# EAGLE design shieldRelay (EAGLE 9.6.2)

## Sheet 1 of 2
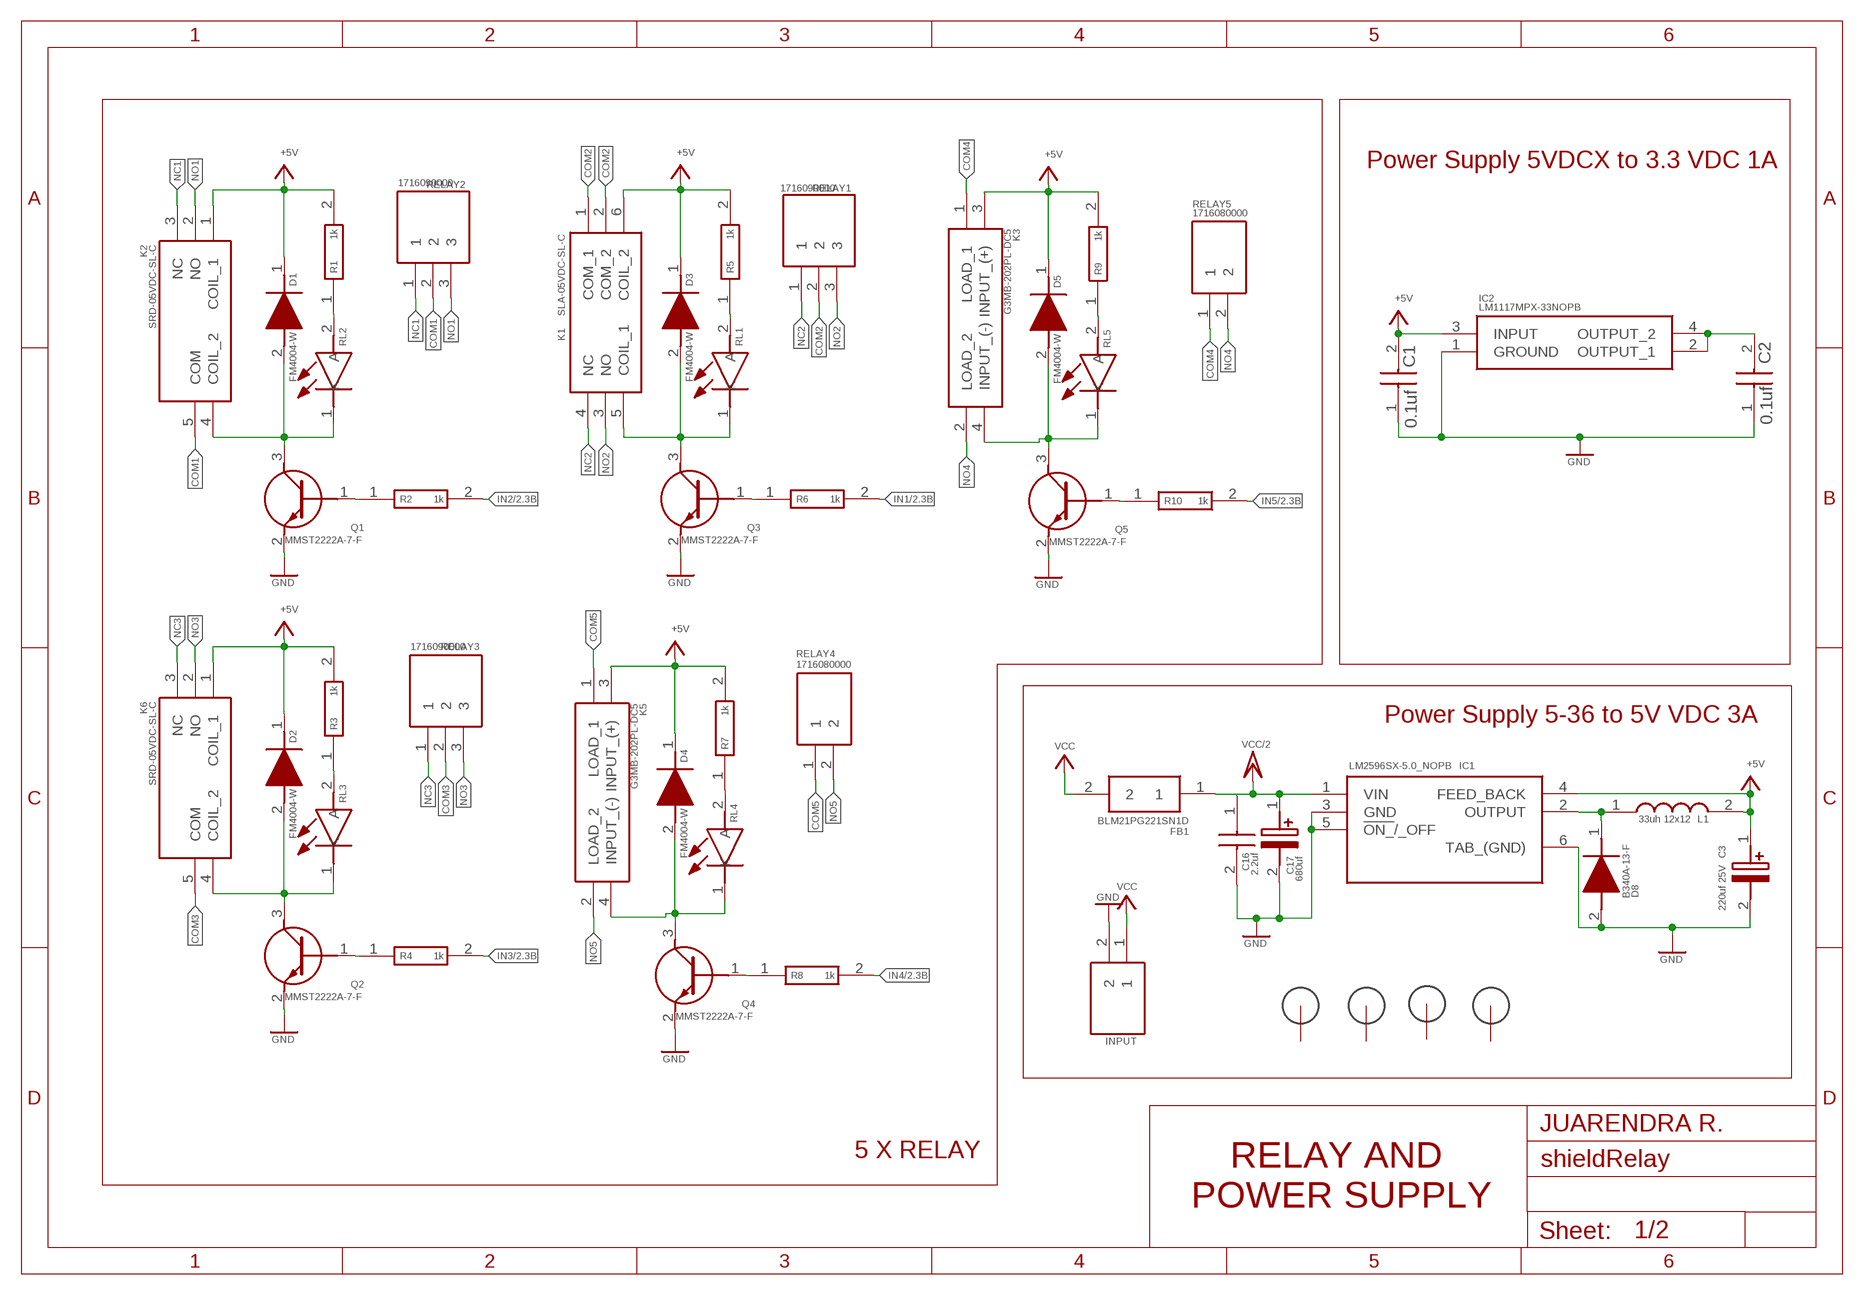
[diagram p0: schematic, sheet 1]

### Parts
C1  0.1uf  KGM15BR71E104KT  [CAPC1608X95N]
C2  0.1uf  KGM15BR71E104KT  [CAPC1608X95N]
C3  220uf 25V  MAL203836221E3  [CAPPRD350W60D850H1250]
C16  2.2uf  KAF21KR71H225KU  [CAPC2012X140N]
C17  680uf  EEH-ZU1V681UP  [EEHZS1H221P]
D1  FM4004-W  [DIONM5025X231N]
D2  FM4004-W  [DIONM5025X231N]
D3  FM4004-W  [DIONM5025X231N]
D4  FM4004-W  [DIONM5025X231N]
D5  FM4004-W  [DIONM5025X231N]
D8  B340A-13-F  [DIOM5226X240N]
FB1  BLM21PG221SN1D  [BEADC2012X105N]
H1  3MM_HOLE  [3MM_HOLE]
H2  3MM_HOLE  [3MM_HOLE]
H3  3MM_HOLE  [3MM_HOLE]
H4  3MM_HOLE  [3MM_HOLE]
IC1  LM2596SX-5.0_NOPB  [KTT0005B]
IC2  LM1117MPX-33NOPB  [SOT230P700X180-4N]
INPUT  1759017  [SHDRRA2W103P0X508_1X2_1016X120]
K1  SLA-05VDC-SL-C  [SLA05VDCSLC]
K2  SRD-05VDC-SL-C  [SRD05VDCSLC]
K3  G3MB-202PL-DC5  [G3MB202PLDC5]
K5  G3MB-202PL-DC5  [G3MB202PLDC5]
K6  SRD-05VDC-SL-C  [SRD05VDCSLC]
L1  33uh 12x12  744770133  [WE-PD_1260/1245/1280/121054]
Q1  MMST2222A-7-F  [SOT65P210X110-3N]
Q2  MMST2222A-7-F  [SOT65P210X110-3N]
Q3  MMST2222A-7-F  [SOT65P210X110-3N]
Q4  MMST2222A-7-F  [SOT65P210X110-3N]
Q5  MMST2222A-7-F  [SOT65P210X110-3N]
R1  1k  ERA-3AED102V  [ERA3AEB101V]
R2  1k  ERA-3AED102V  [ERA3AEB101V]
R3  1k  ERA-3AED102V  [ERA3AEB101V]
R4  1k  ERA-3AED102V  [ERA3AEB101V]
R5  1k  ERA-3AED102V  [ERA3AEB101V]
R6  1k  ERA-3AED102V  [ERA3AEB101V]
R7  1k  ERA-3AED102V  [ERA3AEB101V]
R8  1k  ERA-3AED102V  [ERA3AEB101V]
R9  1k  ERA-3AED102V  [ERA3AEB101V]
R10  1k  ERA-3AED102V  [ERA3AEB101V]
RELAY1  1716090000  [SHDR3W95P0X508_1X3_1524X1000X1]
RELAY2  1716090000  [SHDR3W95P0X508_1X3_1524X1000X1]
RELAY3  1716090000  [SHDR3W95P0X508_1X3_1524X1000X1]
RELAY4  1716080000  [1716080000]
RELAY5  1716080000  [1716080000]
RL1  150080SS75000  [LEDC2012X80N]
RL2  150080SS75000  [LEDC2012X80N]
RL3  150080SS75000  [LEDC2012X80N]
RL4  150080SS75000  [LEDC2012X80N]
RL5  150080SS75000  [LEDC2012X80N]

### Nets
+5V: C1.2 C3.1(+) D1.1(K) D2.1(K) D3.1(K) D4.1(K) D5.1(K) IC1.4(FEED_BACK) IC2.3(INPUT) K1.6(COIL_2) K2.1(COIL_1) K3.3(INPUT_(+)) K5.3(INPUT_(+)) K6.1(COIL_1) L1.2 R1.2 R3.2 R5.2 R7.2 R9.2 ; also sheet 2
COM1: K2.5(COM) RELAY2.2
COM2: K1.1(COM_1) K1.2(COM_2) RELAY1.2
COM3: K6.5(COM) RELAY3.2
COM4: K3.1(LOAD_1) RELAY5.1
COM5: K5.1(LOAD_1) RELAY4.1
GND: C1.1 C2.1 C3.2(-) C16.2 C17.2(-) D8.2(A) IC1.3(GND) IC1.5(!ON_!/_OFF) IC1.6(TAB_(GND)) IC2.1(GROUND) INPUT.2 Q1.2(E) Q2.2(E) Q3.2(E) Q4.2(E) Q5.2(E) ; also sheet 2
IN1: R6.2 ; also sheet 2
IN2: R2.2 ; also sheet 2
IN3: R4.2 ; also sheet 2
IN4: R8.2 ; also sheet 2
IN5: R10.2 ; also sheet 2
N$1: R3.1 RL3.2(A)
N$2: R1.1 RL2.2(A)
N$3: D1.2(A) K2.4(COIL_2) Q1.3(C) RL2.1(K)
N$4: Q1.1(B) R2.1
N$5: D2.2(A) K6.4(COIL_2) Q2.3(C) RL3.1(K)
N$6: Q2.1(B) R4.1
N$7: R5.1 RL1.2(A)
N$8: D3.2(A) K1.5(COIL_1) Q3.3(C) RL1.1(K)
N$9: Q3.1(B) R6.1
N$10: R7.1 RL4.2(A)
N$11: D4.2(A) K5.4(INPUT_(-)) Q4.3(C) RL4.1(K)
N$12: Q4.1(B) R8.1
N$13: R9.1 RL5.2(A)
N$14: D5.2(A) K3.4(INPUT_(-)) Q5.3(C) RL5.1(K)
N$15: Q5.1(B) R10.1
N$18: D8.1(K) IC1.2(OUTPUT) L1.1
N$38: C2.2 IC2.2(OUTPUT_1) IC2.4(OUTPUT_2)
NC1: K2.3(NC) RELAY2.1
NC2: K1.4(NC) RELAY1.1
NC3: K6.3(NC) RELAY3.1
NO1: K2.2(NO) RELAY2.3
NO2: K1.3(NO) RELAY1.3
NO3: K6.2(NO) RELAY3.3
NO4: K3.2(LOAD_2) RELAY5.2
NO5: K5.2(LOAD_2) RELAY4.2
VCC: FB1.2 INPUT.1
VCC/2: C16.1 C17.1(+) FB1.1 IC1.1(VIN) ; also sheet 2
Unconnected: H1.P$1(GND) H1.P$2(GND) H1.P$3(GND) H1.P$4(GND) H1.P$5(GND) H1.P$6(GND) H1.P$7(GND) H1.P$8(GND) H1.P$9(GND) H2.P$1(GND) H2.P$2(GND) H2.P$3(GND) H2.P$4(GND) H2.P$5(GND) H2.P$6(GND) H2.P$7(GND) H2.P$8(GND) H2.P$9(GND) H3.P$1(GND) H3.P$2(GND) H3.P$3(GND) H3.P$4(GND) H3.P$5(GND) H3.P$6(GND) H3.P$7(GND) H3.P$8(GND) H3.P$9(GND) H4.P$1(GND) H4.P$2(GND) H4.P$3(GND) H4.P$4(GND) H4.P$5(GND) H4.P$6(GND) H4.P$7(GND) H4.P$8(GND) H4.P$9(GND)

### Notes on the sheet
- Power Supply 5VDCX to 3.3 VDC 1A
- Power Supply 5-36 to 5V VDC 3A
- JUARENDRA R.
- 5 X RELAY
- RELAY AND 
  POWER SUPPLY

## Sheet 2 of 2
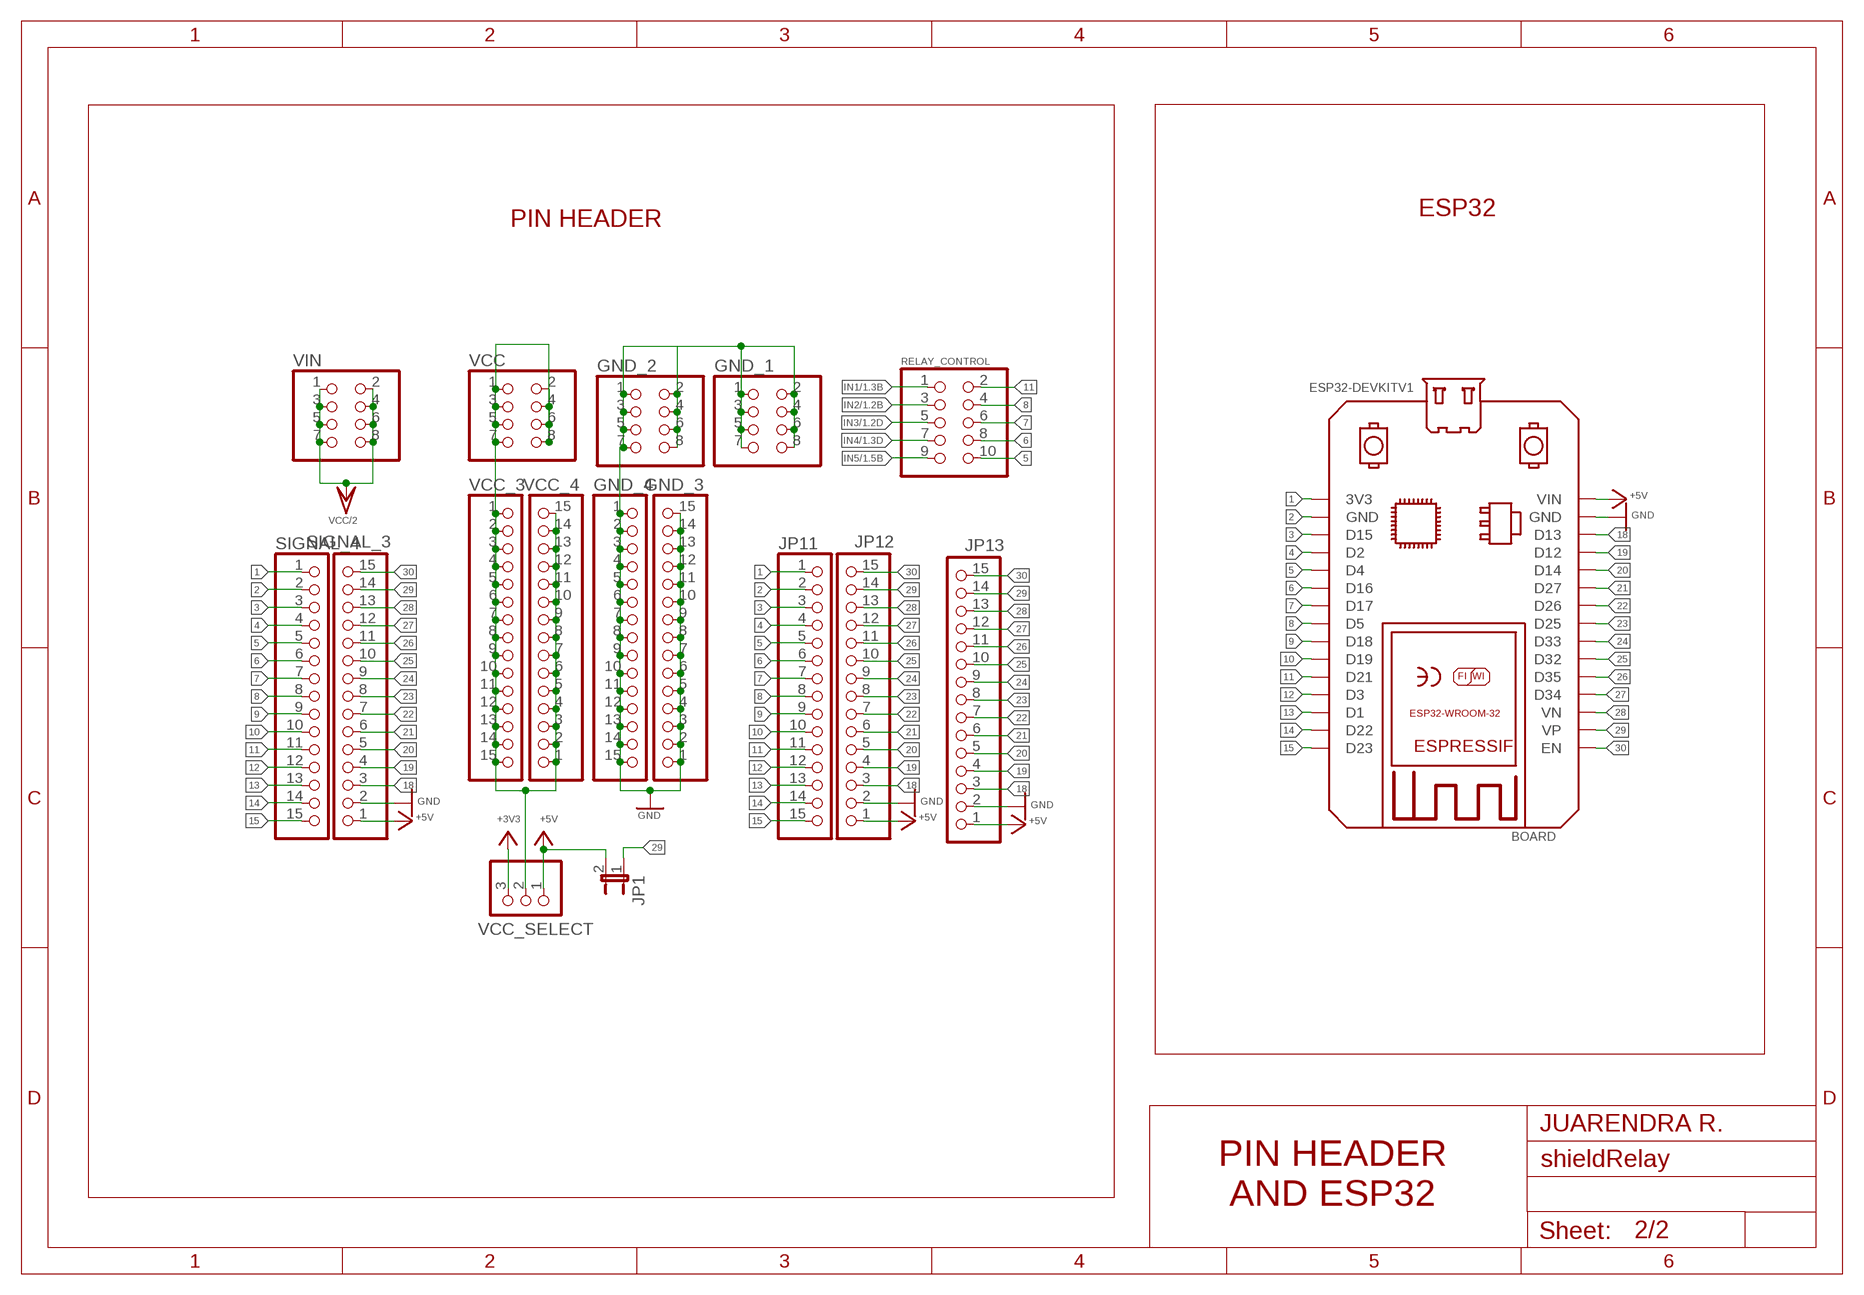
[diagram p1: schematic, sheet 2]

### Parts
BOARD  ESP32DEVKITV1  [ESP32-DEVKITV1]
GND_1  PINHD-2X4  [2X04]
GND_2  PINHD-2X4  [2X04]
GND_3  PINHD-1X15  [1X15]
GND_4  PINHD-1X15  [1X15]
JP1  JP1E  [JP1]
JP11  PINHD-1X15  [1X15]
JP12  PINHD-1X15  [1X15]
JP13  PINHD-1X15  [1X15]
RELAY_CONTROL  PINHD-2X5  [2X05]
SIGNAL_3  PINHD-1X15  [1X15]
SIGNAL_4  PINHD-1X15  [1X15]
VCC  PINHD-2X4  [2X04]
VCC_3  PINHD-1X15  [1X15]
VCC_4  PINHD-1X15  [1X15]
VCC_SELECT  PINHD-1X3  [1X03]
VIN  PINHD-2X4  [2X04]

### Nets
1: BOARD.3V3 JP11.1 SIGNAL_4.1
2: BOARD.GND@1(GND) JP11.2 SIGNAL_4.2
3: BOARD.D15 JP11.3 SIGNAL_4.3
4: BOARD.D2 JP11.4 SIGNAL_4.4
5: BOARD.D4 JP11.5 RELAY_CONTROL.10 SIGNAL_4.5
6: BOARD.D16 JP11.6 RELAY_CONTROL.8 SIGNAL_4.6
7: BOARD.D17 JP11.7 RELAY_CONTROL.6 SIGNAL_4.7
8: BOARD.D5 JP11.8 RELAY_CONTROL.4 SIGNAL_4.8
9: BOARD.D18 JP11.9 SIGNAL_4.9
10: BOARD.D19 JP11.10 SIGNAL_4.10
11: BOARD.D21 JP11.11 RELAY_CONTROL.2 SIGNAL_4.11
12: BOARD.D3 JP11.12 SIGNAL_4.12
13: BOARD.D1 JP11.13 SIGNAL_4.13
14: BOARD.D22 JP11.14 SIGNAL_4.14
15: BOARD.D23 JP11.15 SIGNAL_4.15
18: BOARD.D13 JP12.3 JP13.3 SIGNAL_3.3
19: BOARD.D12 JP12.4 JP13.4 SIGNAL_3.4
20: BOARD.D14 JP12.5 JP13.5 SIGNAL_3.5
21: BOARD.D27 JP12.6 JP13.6 SIGNAL_3.6
22: BOARD.D26 JP12.7 JP13.7 SIGNAL_3.7
23: BOARD.D25 JP12.8 JP13.8 SIGNAL_3.8
24: BOARD.D33 JP12.9 JP13.9 SIGNAL_3.9
25: BOARD.D32 JP12.10 JP13.10 SIGNAL_3.10
26: BOARD.D35 JP12.11 JP13.11 SIGNAL_3.11
27: BOARD.D34 JP12.12 JP13.12 SIGNAL_3.12
28: BOARD.VN JP12.13 JP13.13 SIGNAL_3.13
29: BOARD.VP JP1.1 JP12.14 JP13.14 SIGNAL_3.14
30: BOARD.EN JP12.15 JP13.15 SIGNAL_3.15
+3V3: VCC_SELECT.3
+5V: BOARD.VIN JP1.2 JP12.1 JP13.1 SIGNAL_3.1 VCC_SELECT.1 ; also sheet 1
GND: BOARD.GND GND_1.1 GND_1.2 GND_1.3 GND_1.4 GND_1.5 GND_1.6 GND_1.7 GND_1.8 GND_2.1 GND_2.2 GND_2.3 GND_2.4 GND_2.5 GND_2.6 GND_2.7 GND_2.8 GND_3.1 GND_3.2 GND_3.3 GND_3.4 GND_3.5 GND_3.6 GND_3.7 GND_3.8 GND_3.9 GND_3.10 GND_3.11 GND_3.12 GND_3.13 GND_3.14 GND_3.15 GND_4.1 GND_4.2 GND_4.3 GND_4.4 GND_4.5 GND_4.6 GND_4.7 GND_4.8 GND_4.9 GND_4.10 GND_4.11 GND_4.12 GND_4.13 GND_4.14 GND_4.15 JP12.2 JP13.2 SIGNAL_3.2 ; also sheet 1
IN1: RELAY_CONTROL.1 ; also sheet 1
IN2: RELAY_CONTROL.3 ; also sheet 1
IN3: RELAY_CONTROL.5 ; also sheet 1
IN4: RELAY_CONTROL.7 ; also sheet 1
IN5: RELAY_CONTROL.9 ; also sheet 1
N$39: VCC.1 VCC.2 VCC.3 VCC.4 VCC.5 VCC.6 VCC.7 VCC.8 VCC_3.1 VCC_3.2 VCC_3.3 VCC_3.4 VCC_3.5 VCC_3.6 VCC_3.7 VCC_3.8 VCC_3.9 VCC_3.10 VCC_3.11 VCC_3.12 VCC_3.13 VCC_3.14 VCC_3.15 VCC_4.1 VCC_4.2 VCC_4.3 VCC_4.4 VCC_4.5 VCC_4.6 VCC_4.7 VCC_4.8 VCC_4.9 VCC_4.10 VCC_4.11 VCC_4.12 VCC_4.13 VCC_4.14 VCC_4.15 VCC_SELECT.2
VCC/2: VIN.1 VIN.2 VIN.3 VIN.4 VIN.5 VIN.6 VIN.7 VIN.8 ; also sheet 1

### Notes on the sheet
- ESP32
- PIN HEADER
- JUARENDRA R.
- PIN HEADER
  AND ESP32

## Library data of the parts
BOARD = ESP32-DEVKITV1:ESP32DEVKITV1: https://github.com/shridattdudhat
C1 C2 = KGM15BR71E104KT:KGM15BR71E104KT: 0603 25 V X7R 100nF +/-10% Source: Datasheet <https://spicat.kyocera-avx.com/product/mlcc/chartview/KGM15BR71E104KT>; DESCRIPTION: 0603 25 V X7R 100nF +/-10%; HEIGHT: 0.95mm; MANUFACTURER_NAME: Kyocera AVX; MANUFACTURER_PART_NUMBER: KGM15BR71E104KT; MOUSER_PART_NUMBER: 581-KGM15BR71E104KT; MOUSER_PRICE-STOCK: https://www.mouser.co.uk/ProductDetail/KYOCERA-AVX/KGM15BR71E104KT?qs=Jm2GQyTW%2FbiCo%2Fby4Q068Q%3D%3D
C3 = MAL203836221E3:MAL203836221E3: VISHAY - MAL203836221E3 - CAP, 220F, 25V, 20% Source: Datasheet; DESCRIPTION: VISHAY - MAL203836221E3 - CAP, 220F, 25V, 20%; HEIGHT: 12.5mm; MANUFACTURER_NAME: Vishay; MANUFACTURER_PART_NUMBER: MAL203836221E3; MOUSER_PART_NUMBER: 594-MAL203836221E3; MOUSER_PRICE-STOCK: https://www.mouser.co.uk/ProductDetail/Vishay-BC-Components/MAL203836221E3?qs=G99oyVYclWUIwcN6B3qC5w%3D%3D
C16 = KAF21KR71H225KU:KAF21KR71H225KU: Multilayer Ceramic Capacitors MLCC - SMD/SMT 50V 2.2uF X7R 0805 10% AEC-Q200 FLEXITERM Source: Datasheet <https://datasheets.kyocera-avx.com/AutoMLCCKAF.pdf>; DESCRIPTION: Multilayer Ceramic Capacitors MLCC - SMD/SMT 50V 2.2uF X7R 0805 10% AEC-Q200 FLEXITERM; HEIGHT: 1.4mm; MANUFACTURER_NAME: Kyocera AVX; MANUFACTURER_PART_NUMBER: KAF21KR71H225KU; MOUSER_PART_NUMBER: 581-KAF21KR71H225KU; MOUSER_PRICE-STOCK: https://www.mouser.co.uk/ProductDetail/KYOCERA-AVX/KAF21KR71H225KU?qs=Jm2GQyTW%2FbjwwNTLmtUMeQ%3D%3D
C17 = EEH-ZU1V681UP:EEH-ZU1V681UP: Conductive Polymer Hybrid Aluminum Electrolytic Capacitor Source: Datasheet <https://industrial.panasonic.com/cdbs/www-data/pdf/RDD0000/ast-ind-280898.pdf>; DESCRIPTION: Conductive Polymer Hybrid Aluminum Electrolytic Capacitor; HEIGHT: 10.5mm; MANUFACTURER_NAME: Panasonic; MANUFACTURER_PART_NUMBER: EEH-ZU1V681UP; MOUSER_PART_NUMBER: 667-EEH-ZU1V681UP; MOUSER_PRICE-STOCK: https://www.mouser.co.uk/ProductDetail/Panasonic/EEH-ZU1V681UP?qs=HoCaDK9Nz5elLexP3akqig%3D%3D
D1-D5 = FM4004-W:FM4004-W: Rectifiers 1N4004 1A 400V Source: Datasheet <https://componentsearchengine.com/Datasheets/1/FM4004-W.pdf>; DESCRIPTION: Rectifiers 1N4004 1A 400V; HEIGHT: 2.31mm; MANUFACTURER_NAME: Rectron; MANUFACTURER_PART_NUMBER: FM4004-W; MOUSER_PART_NUMBER: 583-FM4004; MOUSER_PRICE-STOCK: https://www.mouser.co.uk/ProductDetail/Rectron/FM4004-W?qs=Iw9Ubr57Px3IHNH1bE4l9w%3D%3D
D8 = B340A-13-F:B340A-13-F: Schottky Diode 3A 40V 0.5Vf SMA Diodes Inc B340A-13-F, SMT Schottky Diode, 40V 3A, 2-Pin DO-214AC Source: Datasheet <https://datasheet.datasheetarchive.com/originals/distributors/Datasheets-305/73551.pdf>; DESCRIPTION: Schottky Diode 3A 40V 0.5Vf SMA Diodes Inc B340A-13-F, SMT Schottky Diode, 40V 3A, 2-Pin DO-214AC; HEIGHT: 2.4mm; MANUFACTURER_NAME: Diodes Incorporated; MANUFACTURER_PART_NUMBER: B340A-13-F; MOUSER_PART_NUMBER: 621-B340A-F; MOUSER_PRICE-STOCK: https://www.mouser.co.uk/ProductDetail/Diodes-Incorporated/B340A-13-F?qs=aLaTXeBcTP9fj%2FYKVo6Q1A%3D%3D
FB1 = BLM21PG221SN1D:BLM21PG221SN1D: Murata Ferrite Bead (Chip Ferrite Bead), 2 x 1.25 x 0.85mm Source: Datasheet <https://datasheet.datasheetarchive.com/originals/dk/DKDS-31/605570.pdf>; DESCRIPTION: Murata Ferrite Bead (Chip Ferrite Bead), 2 x 1.25 x 0.85mm; HEIGHT: 1.05mm; MANUFACTURER_NAME: Murata Electronics; MANUFACTURER_PART_NUMBER: BLM21PG221SN1D; MOUSER_PART_NUMBER: 81-BLM21P221SG; MOUSER_PRICE-STOCK: https://www.mouser.co.uk/ProductDetail/Murata-Electronics/BLM21PG221SN1D?qs=N%2FLoXOA9PTJ4i6RHFrsqmw%3D%3D
GND_1 GND_2 VCC VIN = pinhead:PINHD-2X4: PIN HEADER
GND_3 GND_4 JP11-JP13 SIGNAL_3 SIGNAL_4 VCC_3 VCC_4 = pinhead_mod:PINHD-1X15: PIN HEADER
H1-H4 = 3mm_special_hole:3MM_HOLE: Cool looking 3mm hole with ground connection
IC1 = LM2596SX-5.0_NOPB:LM2596SX-5.0_NOPB: SIMPLE SWITCHER® 4.5V to 40V, 3A Low Component Count Step-Down Regulator Source: Datasheet <http://www.ti.com/lit/gpn/lm2596>; DESCRIPTION: SIMPLE SWITCHER&#174; 4.5V to 40V, 3A Low Component Count Step-Down Regulator; HEIGHT: mm; MANUFACTURER_NAME: Texas Instruments; MANUFACTURER_PART_NUMBER: LM2596SX-5.0/NOPB; MOUSER_PART_NUMBER: 926-LM2596SX-5.0NOPB; MOUSER_PRICE-STOCK: https://www.mouser.co.uk/ProductDetail/Texas-Instruments/LM2596SX-5.0-NOPB?qs=X1J7HmVL2ZGZ5T4VcWdmNw%3D%3D
IC2 = LM1117MPX-33NOPB:LM1117MPX-33NOPB: LDO Voltage Regulators 800-mA 15-V linear voltage regulator 800-mA 15-V linear voltage regulator Source: Datasheet <https://www.arrow.com/en/products/lm1117mpx-33nopb/on-semiconductor>; DESCRIPTION: LDO Voltage Regulators 800-mA 15-V linear voltage regulator 800-mA 15-V linear voltage regulator; HEIGHT: 1.8mm; MANUFACTURER_NAME: onsemi; MANUFACTURER_PART_NUMBER: LM1117MPX-33NOPB; MOUSER_PART_NUMBER: 863-LM1117MPX-33NOPB; MOUSER_PRICE-STOCK: https://www.mouser.co.uk/ProductDetail/onsemi/LM1117MPX-33NOPB?qs=DPoM0jnrROUIbzbQHFmeig%3D%3D
INPUT = 1759017:1759017: PCB header, nominal cross section: 2.5 mm?, color: green, nominal current: 12 A, rated voltage (III/2): 320 V, contact surface: Tin, type of contact: Male connector, Number of potentials: 2, Number of rows: 1, Number of positions per row: 2, number of connections: 2, product range: MSTB 2,5/..-G, pitch: 5.08 mm, mounting: Wave soldering, pin layout: Linear pinning, solder pin [P]: 3.5 mm, Stecksystem: CLASSIC COMBICON, Locking: without, type of packaging: packed in cardboard Source: Datasheet <http://www.phoenixcontact.com/de/produkte/1759017/pdf>; DESCRIPTION: PCB header, nominal cross section: 2.5 mm?, color: green, nominal current: 12 A, rated voltage (III/2): 320 V, contact surface: Tin, type of contact: Male connector, Number of potentials: 2, Number of rows: 1, Number of positions per row: 2, number of connections: 2, product range: MSTB 2,5/..-G, pitch: 5.08 mm, mounting: Wave soldering, pin layout: Linear pinning, solder pin [P]: 3.5 mm, Stecksystem: CLASSIC COMBICON, Locking: without, type of packaging: packed in cardboard; HEIGHT: 8.72mm; MANUFACTURER_NAME: Phoenix Contact; MANUFACTURER_PART_NUMBER: 1759017; MOUSER_PART_NUMBER: 651-1759017; MOUSER_PRICE-STOCK: https://www.mouser.co.uk/ProductDetail/Phoenix-Contact/1759017?qs=BYlwlsDsB%2FoOYIHqYLxOcg%3D%3D
JP1 = jumper:JP1E: JUMPER
K1 = SLA-05VDC-SL-C:SLA-05VDC-SL-C: Relays General Purpose Non Latching 5VDC SPDT 30A (250VAC) Max Plugin RoHS Source: Datasheet <https://datasheet.lcsc.com/szlcsc/Ningbo-Songle-Relay-SLA-05VDC-SL-C_C87367.pdf>; DESCRIPTION: Relays General Purpose Non Latching 5VDC SPDT 30A (250VAC) Max Plugin RoHS; HEIGHT: 20.4mm; MANUFACTURER_NAME: Songle Relay; MANUFACTURER_PART_NUMBER: SLA-05VDC-SL-C
K2 K6 = SRD-05VDC-SL-C:SRD-05VDC-SL-C: SRD-05VDC-SL-C; RELAY ISO9002 1. MAIN FEATURES Switching capacity available by 10A in spite of small size design for highdensity P.C. board mounting technique. U Source: Datasheet <http://www.songlerelay.com/Public/Uploads/20161104/581c81ac16e36.pdf>; DESCRIPTION: SRD-05VDC-SL-C; RELAY ISO9002 1. MAIN FEATURES Switching capacity available by 10A in spite of small size design for highdensity P.C. board mounting technique. U; HEIGHT: 15.8mm; MANUFACTURER_NAME: EAGLE; MANUFACTURER_PART_NUMBER: SRD-05VDC-SL-C
K3 K5 = G3MB-202PL-DC5:G3MB-202PL-DC5: Solid State Relays - PCB Mount 5VDC/100-240VAC 2A Source: Datasheet <https://www.mouser.com/datasheet/2/307/g3mb_0609-1189645.pdf>; DESCRIPTION: Solid State Relays - PCB Mount 5VDC/100-240VAC 2A; HEIGHT: 20.5mm; MANUFACTURER_NAME: Omron Electronics; MANUFACTURER_PART_NUMBER: G3MB-202PL-DC5; MOUSER_PART_NUMBER: 653-G3MB-202PL-DC5; MOUSER_PRICE-STOCK: https://www.mouser.co.uk/ProductDetail/Omron-Automation-and-Safety/G3MB-202PL-DC5?qs=CX134%252BdLMDF4X9k4CH7R5g%3D%3D
L1 = 744770133:744770133: Wurth WE-PD Series Shielded Wire-wound SMD Inductor with a Ferrite Core, 33 uH +/-20% 3.6A Idc Source: Datasheet; DESCRIPTION: Wurth WE-PD Series Shielded Wire-wound SMD Inductor with a Ferrite Core, 33 uH +/-20% 3.6A Idc; HEIGHT: mm; MANUFACTURER_NAME: Wurth Elektronik; MANUFACTURER_PART_NUMBER: 744770133; MOUSER_PART_NUMBER: 710-744770133; MOUSER_PRICE-STOCK: https://www.mouser.co.uk/ProductDetail/Wurth-Elektronik/744770133?qs=E%2F%2FhvbtCqpPKkGJl8TxFXw%3D%3D
Q1-Q5 = MMST2222A-7-F:MMST2222A-7-F: Bipolar (BJT) Transistor NPN 40 V 600 mA 300MHz 200 mW Surface Mount SOT-323 Source: Datasheet <https://www.diodes.com/assets/Datasheets/ds30080.pdf>; DESCRIPTION: Bipolar (BJT) Transistor NPN 40 V 600 mA 300MHz 200 mW Surface Mount SOT-323; HEIGHT: 1.1mm; MANUFACTURER_NAME: Diodes Incorporated; MANUFACTURER_PART_NUMBER: MMST2222A-7-F; MOUSER_PART_NUMBER: 621-MMST2222A-F; MOUSER_PRICE-STOCK: https://www.mouser.co.uk/ProductDetail/Diodes-Incorporated/MMST2222A-7-F?qs=B0AElM0L7fPu4CagNNXsRQ%3D%3D
R1-R10 = ERA-3AED102V:ERA-3AED102V: Thin Film Resistors - SMD 0603 1000ohms 25ppm 0.5% AEC-Q200 Source: Datasheet <https://industrial.panasonic.com/cdbs/www-data/pdf/RDM0000/AOA0000C307.pdf>; DESCRIPTION: Thin Film Resistors - SMD 0603 1000ohms 25ppm 0.5% AEC-Q200; HEIGHT: 0.55mm; MANUFACTURER_NAME: Panasonic; MANUFACTURER_PART_NUMBER: ERA-3AED102V; MOUSER_PART_NUMBER: 667-ERA-3AED102V; MOUSER_PRICE-STOCK: https://www.mouser.co.uk/ProductDetail/Panasonic/ERA-3AED102V?qs=yocZuyCaXdNrh6oeFjCchg%3D%3D
RELAY1-RELAY3 = 1716090000:1716090000: Printed circuit board terminals, 5.08 mm, Number of poles: 3, 90, Solder pin length: 3.5 mm, tinned, orange, Clamping yoke connection, Clamping range, max. [rated connection]: 2.5 mm, Box Source: Datasheet <http://catalog.weidmueller.com/createDatasheetForMobile.do?ordernumber=1716090000&scope1=1&scope2=1&localeId=en>; DESCRIPTION: Printed circuit board terminals, 5.08 mm, Number of poles: 3, 90, Solder pin length: 3.5 mm, tinned, orange, Clamping yoke connection, Clamping range, max. [rated connection]: 2.5 mm, Box; HEIGHT: 13.8mm; MANUFACTURER_NAME: Weidmuller; MANUFACTURER_PART_NUMBER: 1716090000; MOUSER_PART_NUMBER: 470-1716090000; MOUSER_PRICE-STOCK: https://www.mouser.co.uk/ProductDetail/Weidmuller/1716090000?qs=BTG2th8YmhRwtiTHzuCKAQ%3D%3D
RELAY4 RELAY5 = 1716080000:1716080000: Printed circuit board terminals, 5.08 mm, Number of poles: 2, 90, Solder pin length: 3.5 mm, tinned, orange, Clamping yoke connection, Clamping range, max. [rated connection]: 2.5 mm, Box Source: Datasheet <http://catalog.weidmueller.com/createDatasheetForMobile.do?ordernumber=1716080000&scope1=1&scope2=1&localeId=en>; DESCRIPTION: Printed circuit board terminals, 5.08 mm, Number of poles: 2, 90, Solder pin length: 3.5 mm, tinned, orange, Clamping yoke connection, Clamping range, max. [rated connection]: 2.5 mm, Box; HEIGHT: 13.8mm; MANUFACTURER_NAME: Weidmuller; MANUFACTURER_PART_NUMBER: 1716080000; MOUSER_PART_NUMBER: 470-1716080000; MOUSER_PRICE-STOCK: https://www.mouser.co.uk/ProductDetail/Weidmuller/1716080000?qs=BTG2th8YmhQnu8ZhPH6LgQ%3D%3D
RELAY_CONTROL = pinhead:PINHD-2X5: PIN HEADER
RL1-RL5 = SamacSys_Parts:150080SS75000: Wurth Elektronik 150080SS75000, WL-SMCW Series Red LED, 630 nm, 2012 (0805) Clear, Rectangle Lens SMD Package Source: Datasheet <https://katalog.we-online.com/led/datasheet/150080SS75000.pdf>; DESCRIPTION: Wurth Elektronik 150080SS75000, WL-SMCW Series Red LED, 630 nm, 2012 (0805) Clear, Rectangle Lens SMD Package; DIGIKEY_PARTNUMBER: 732-4985-1-ND; DIGIKEY_PRICE-STOCK: https://www.digikey.com/product-detail/en/w%C3%BCrth-elektronik/150080SS75000/732-4985-1-ND/4489919; HEIGHT: 0.8mm; MANUFACTURER_NAME: Wurth Elektronik; MANUFACTURER_PART_NUMBER: 150080SS75000; MOUSER_PART_NUMBER: 710-150080SS75000; MOUSER_PRICE-STOCK: https://www.mouser.co.uk/ProductDetail/Wurth-Elektronik/150080SS75000?qs=LlUlMxKIyB2zzpiaOzrUdw%3D%3D
VCC_SELECT = pinhead:PINHD-1X3: PIN HEADER

## Board
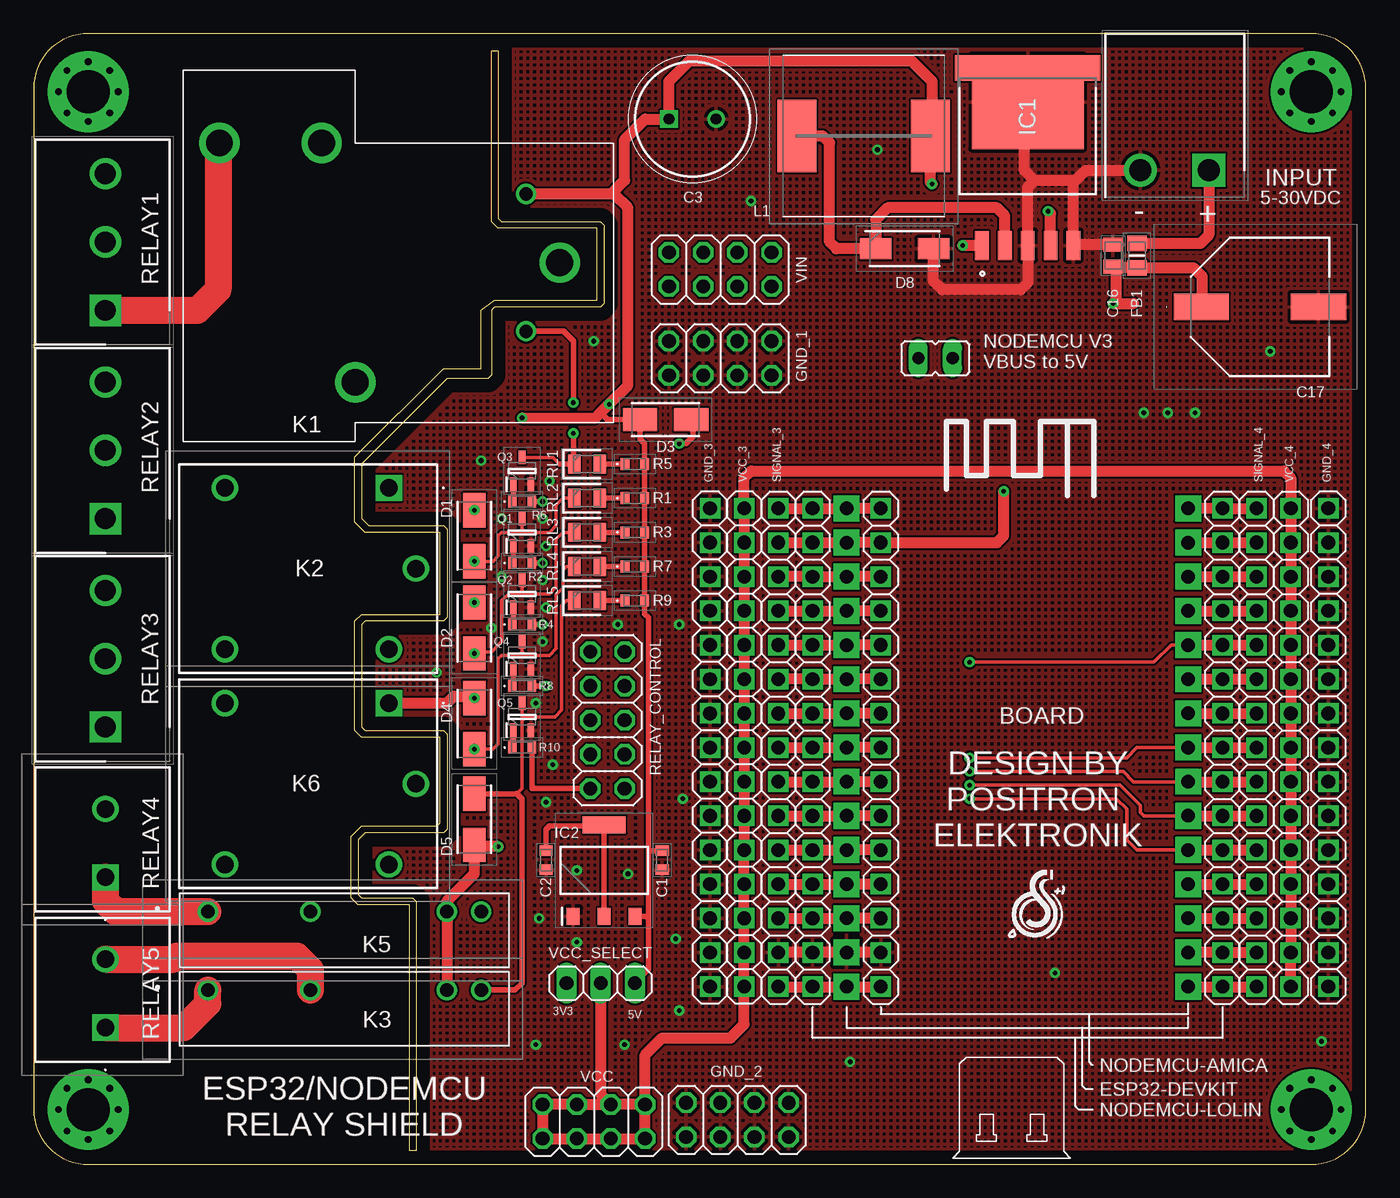
[diagram p2: board, top side]
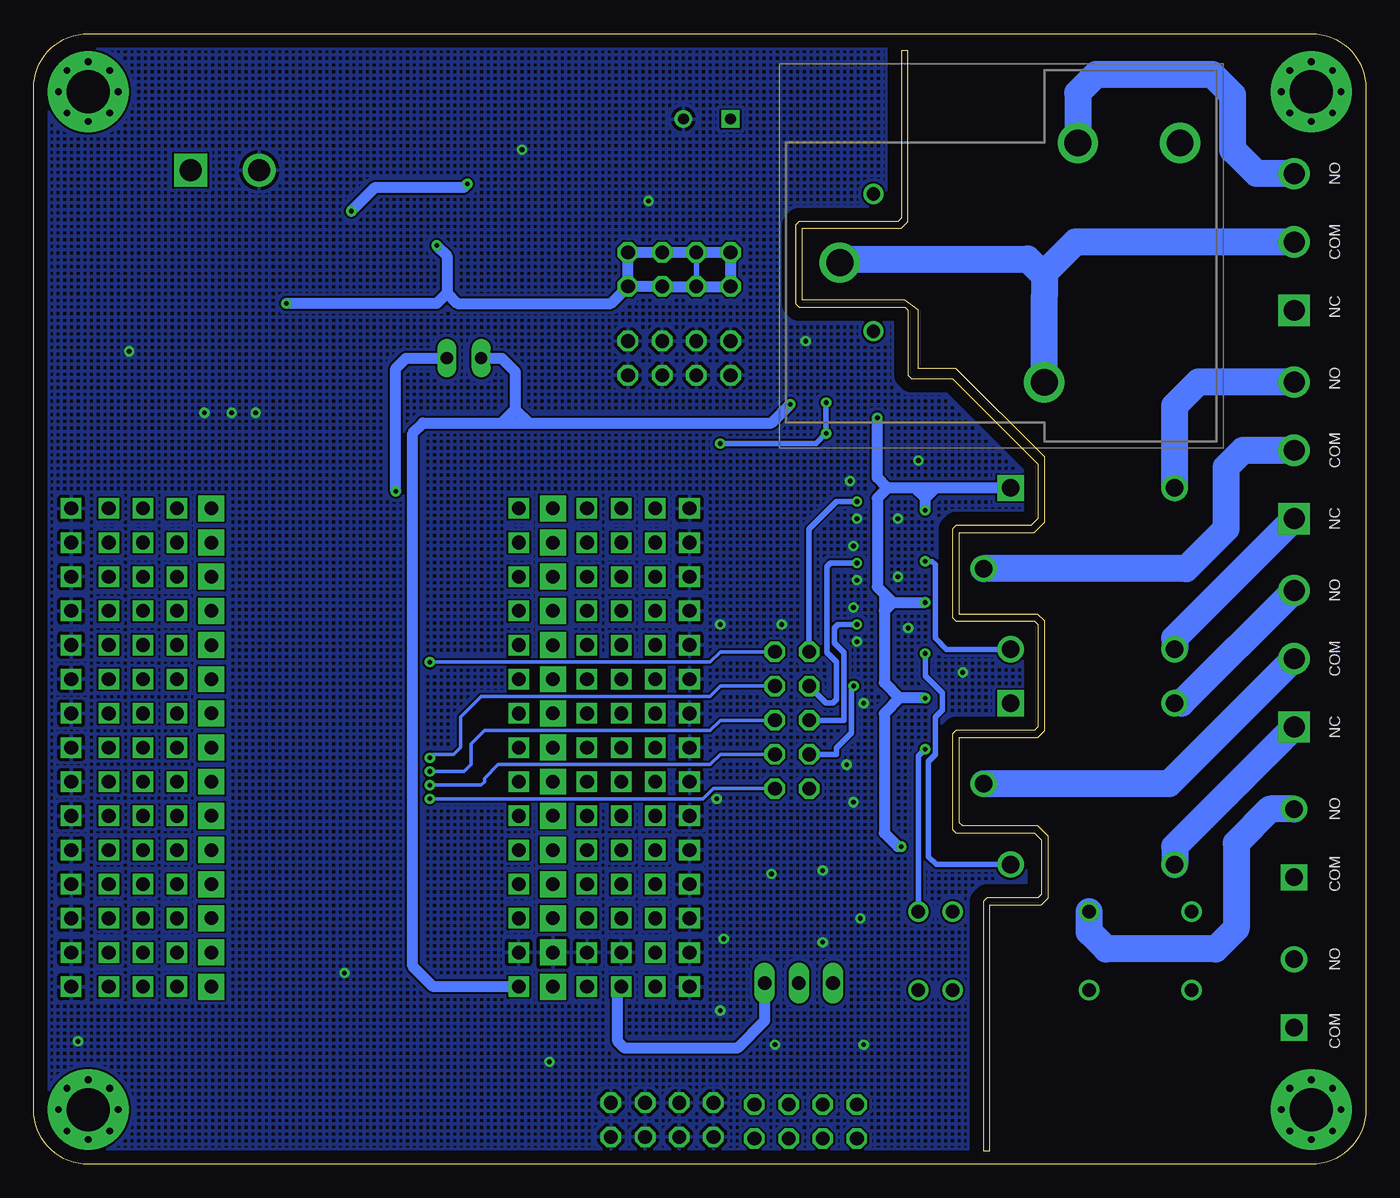
[diagram p3: board, bottom side, seen from below]

Size 99.06 x 84.07 mm. Coordinates in mm from the lower left corner, seen from the top.
Outline: 4.06,84.07 arc90 0,80.01 0,4.06 arc90 4.06,0 95,0 arc90 99.06,4.06 99.06,80.01 arc90 95,84.07 4.06,84.07
Outline: 34.54,82.8 34.54,70.36 34.8,70.1 42.16,70.1 42.42,69.85 42.42,64.01 42.16,63.75 34.29,63.75 34.04,63.5 34.04,58.67 33.78,58.42 30.73,58.42 24.38,52.07 24.38,48.01 24.89,47.5 30.48,47.5 30.73,47.24 30.73,40.64 30.48,40.39 24.64,40.39 24.38,40.13 24.38,32.51 24.64,32.26 30.48,32.26 30.73,32 30.73,24.89 30.48,24.64 24.64,24.64 24.13,24.13 24.13,20.07 24.38,19.81 28.19,19.81 28.45,19.56 28.45,1.02 27.94,1.02 27.94,19.3 24.13,19.3 23.62,19.81 23.62,24.38 24.38,25.15 29.97,25.15 30.23,25.4 30.23,31.75 24.38,31.75 23.88,32.26 23.88,40.39 24.38,40.89 30.23,40.89 30.23,46.99 24.64,46.99 23.88,47.75 23.88,52.58 30.48,59.18 33.27,59.18 33.27,63.5 34.29,64.26 41.91,64.26 41.91,69.6 34.54,69.6 34.04,70.1 34.04,82.8 34.54,82.8
Copper layers (1*16): Top 0.035mm / dielectric 1.5mm / Bottom 0.035mm
Design rules "default *": minimum track width 6mil, minimum drill 0.35mm, track to track 6mil, track to pad 6mil, pad to pad 6mil, via to via 6mil, smd to smd 6mil, copper to edge 40mil, drill to drill 6mil, minimum pad ring 10mil, minimum via ring 8mil, stop-mask expansion 4mil, vias tented up to drill 0.36mm, thermal gap 10mil

### Footprints (pad centres in the part's own frame; a part is rotated, then mirrored left to right if it is on the bottom)
ESP32-DEVKITV1 = drill 1 pad 1.93 square: 3V3 0,0; D1 30.48,0; D2 7.62,0; D3 27.94,0; D4 10.16,0; D5 17.78,0; D12 7.62,25.4; D13 5.08,25.4; D14 10.16,25.4; D15 5.08,0; D16 12.7,0; D17 15.24,0; D18 20.32,0; D19 22.86,0; D21 25.4,0; D22 33.02,0; D23 35.56,0; D25 17.78,25.4; D26 15.24,25.4; D27 12.7,25.4; D32 22.86,25.4; D33 20.32,25.4; D34 27.94,25.4; D35 25.4,25.4; EN 35.56,25.4; GND 2.54,25.4; GND@1 2.54,0; VIN 0,25.4; VN 30.48,25.4; VP 33.02,25.4
CAPC1608X95N = smd 0.78 x 0.99: 1 -0.7,0; 2 0.7,0
CAPPRD350W60D850H1250 = drill 0.8 pad 1.2 square: 1 0,0 | drill 0.8 pad 1.2: 2 3.5,0
CAPC2012X140N = smd 1.02 x 1.47: 1 -0.81,0; 2 0.81,0
EEHZS1H221P = smd 4.1 x 2: 1 -4.35,0; 2 4.35,0
DIONM5025X231N = smd 2.55 x 1.7: 1 -1.9,0; 2 1.9,0
DIOM5226X240N = smd 2.35 x 1.55: 1 -2.15,0; 2 2.15,0
BEADC2012X105N = smd 1.15 x 1.45: 1 -0.9,0; 2 0.9,0
2X04 = drill 1.016 octagon: 1 -3.81,-1.27; 2 -3.81,1.27; 3 -1.27,-1.27; 4 -1.27,1.27; 5 1.27,-1.27; 6 1.27,1.27; 7 3.81,-1.27; 8 3.81,1.27
1X15 = drill 1.016 square: 1 -17.78,0; 2 -15.24,0; 3 -12.7,0; 4 -10.16,0; 5 -7.62,0; 6 -5.08,0; 7 -2.54,0; 8 0,0; 9 2.54,0; 10 5.08,0; 11 7.62,0; 12 10.16,0; 13 12.7,0; 14 15.24,0; 15 17.78,0
3MM_HOLE = drill 3.2 pad 6: P$1 0,0 | drill 0.5 pad 0.61: P$2 0,2.223; P$3 0,-2.223; P$4 2.223,0; P$5 -2.223,0; P$6 -1.587,1.587; P$7 1.587,1.587; P$8 1.587,-1.587; P$9 -1.587,-1.587
KTT0005B = smd 2.16 x 1.02: 1 12.461,-3.4; 2 12.461,-1.7; 3 12.461,0; 4 12.461,1.7; 5 12.461,3.4 | smd 6.99 x 8.33: 6 1.786,0 | smd 1.91 x 1.235: 7 -0.754,4.782; 8 -0.754,-4.782
SOT230P700X180-4N = smd 1.25 x 0.95: 1 -3.4,2.3; 2 -3.4,0; 3 -3.4,-2.3 | smd 1.25 x 3.2: 4 3.4,0
SHDRRA2W103P0X508_1X2_1016X120 = drill 1.65 pad 2.475 square: 1 0,0 | drill 1.65 pad 2.475: 2 -5.08,0
JP1 = drill 0.914 long: 1 0,-1.27; 2 0,1.27
SLA05VDCSLC = drill 2 pad 3: 1 0,0; 2 8.9,15.2; 3 -8.9,17.7; 4 -8.9,25.3 | drill 1 pad 1.5: 5 5.1,2.5; 6 -5.1,2.5
SRD05VDCSLC = drill 1.3 pad 1.95 square: 1 0,0 | drill 1.3 pad 1.95: 2 12.2,0; 3 12.2,12; 4 0,12; 5 -2,6
G3MB202PLDC5 = drill 1 pad 1.5: 1 0,0; 2 -7.62,0; 3 -17.78,0; 4 -20.32,0
WE-PD_1260/1245/1280/121054 = smd 2.9 x 5.4: 1 -4.95,0; 2 4.95,0
SOT65P210X110-3N = smd 1 x 0.5: 1 -1,0.65; 2 -1,-0.65; 3 1,0
ERA3AEB101V = smd 0.65 x 0.9: 1 -0.725,0; 2 0.725,0
SHDR3W95P0X508_1X3_1524X1000X1 = drill 1.55 pad 2.325 square: 1 0,0 | drill 1.55 pad 2.325: 2 5.08,0; 3 10.16,0
1716080000 = drill 1.3 pad 1.95 square: 1 0,0 | drill 1.3 pad 1.95: 2 5.08,0
2X05 = drill 1.016 octagon: 1 -5.08,-1.27; 2 -5.08,1.27; 3 -2.54,-1.27; 4 -2.54,1.27; 5 0,-1.27; 6 0,1.27; 7 2.54,-1.27; 8 2.54,1.27; 9 5.08,-1.27; 10 5.08,1.27
LEDC2012X80N = smd 0.9 x 1.4: 1 -0.95,0; 2 0.95,0
1X03 = drill 1.016 long: 1 -2.54,0; 2 0,0; 3 2.54,0

### Placement (x,y rotation side)
BOARD  85.85,13.21 90 top
C1  46.74,22.61 90 top
C2  38.1,22.61 90 top
C3  47.24,77.72 0 top
C16  80.26,67.56 90 top
C17  91.19,63.75 0 top
D1  32.77,46.74 270 top
D2  32.77,39.88 270 top
D3  46.99,55.37 0 top
D4  32.77,32.77 270 top
D5  32.77,25.65 90 top
D8  64.77,68.07 0 top
FB1  82.04,67.56 90 top
GND_1  51.05,59.94 0 top
GND_2  52.32,3.3 0 top
GND_3  50.29,30.99 270 top
GND_4  96.27,30.99 270 top
H1  4.06,79.76 0 top
H2  95,79.76 0 top
H3  95,4.06 0 top
H4  4.06,4.06 0 top
IC1  73.91,80.77 270 top
IC2  42.42,21.84 90 top
INPUT  87.38,73.91 0 top
JP1  67.06,59.94 90 top
JP11  88.39,30.99 90 top
JP12  57.91,30.99 90 top
JP13  62.99,30.99 90 top
K1  39.12,67.05 270 bottom
K2  26.42,50.29 180 top
K3  12.95,12.95 180 top
K5  12.95,18.8 180 top
K6  26.42,34.29 180 top
L1  61.72,76.45 0 top
Q1  36.32,46.99 90 top
Q2  36.32,42.42 90 top
Q3  36.32,51.56 90 top
Q4  36.32,37.85 90 top
Q5  36.32,33.27 90 top
R1  44.7,49.53 0 top
R2  36.32,44.7 0 top
R3  44.7,46.99 0 top
R4  36.32,40.13 0 top
R5  44.7,52.07 0 top
R6  36.32,49.28 0 top
R7  44.7,44.45 0 top
R8  36.32,35.56 0 top
R9  44.7,41.91 0 top
R10  36.32,30.99 0 top
RELAY1  5.33,63.5 90 top
RELAY2  5.33,48.01 90 top
RELAY3  5.33,32.51 90 top
RELAY4  5.33,21.34 90 top
RELAY5  5.33,10.16 90 top
RELAY_CONTROL  42.67,33.02 270 top
RL1  41.15,52.07 0 top
RL2  41.15,49.53 0 top
RL3  41.15,46.99 0 top
RL4  41.15,44.45 0 top
RL5  41.15,41.91 0 top
SIGNAL_3  55.37,30.99 90 top
SIGNAL_4  90.93,30.99 90 top
VCC  41.66,3.18 0 top
VCC_3  52.83,30.99 270 top
VCC_4  93.47,30.99 90 top
VCC_SELECT  42.16,13.46 180 top
VIN  51.05,66.55 0 top

### Tracks (layer width: path | path; a pad name or v marks a point on that pad's centre or on a via)
1
  Top 0.813: BOARD.3V3 JP11.1 SIGNAL_4.1
2
  Top 0.813: BOARD.GND@1 JP11.2 SIGNAL_4.2
3
  Top 0.813: BOARD.D15 JP11.3 SIGNAL_4.3
4
  Top 0.813: BOARD.D2 JP11.4 SIGNAL_4.4
5  (via drill 0.35)
  Top 0.254: v69.6,27.18 80.52,27.18 81.28,26.42 81.28,24.13 82.04,23.37 BOARD.D4
  Top 0.813: BOARD.D4 JP11.5 SIGNAL_4.5
  Bottom 0.254: RELAY_CONTROL.10 48.51,27.94 49.28,27.18 v69.6,27.18
6  (via drill 0.35)
  Top 0.254: v69.6,28.19 80.77,28.19 82.3,26.67 82.3,26.16 82.55,25.91 BOARD.D16
  Top 0.813: BOARD.D16 JP11.6 SIGNAL_4.6
  Bottom 0.254: RELAY_CONTROL.8 48.01,30.48 48.77,29.72 64.52,29.72 65.53,28.7 65.53,28.45 65.79,28.19 v69.6,28.19
7  (via drill 0.35)
  Top 0.254: v69.6,29.21 81.03,29.21 81.79,28.45 86.36,28.45
  Top 0.813: BOARD.D17 86.36,28.45 JP11.7 SIGNAL_4.7
  Bottom 0.254: RELAY_CONTROL.6 48.01,33.02 48.77,32.26 65.53,32.26 66.55,31.24 66.55,29.72 67.06,29.21 v69.6,29.21
8  (via drill 0.35)
  Top 0.254: v69.6,30.23 81.28,30.23 82.04,30.99 BOARD.D5
  Top 0.813: BOARD.D5 JP11.8 SIGNAL_4.8
  Bottom 0.254: RELAY_CONTROL.4 48.01,35.56 48.77,34.8 65.79,34.8 67.31,33.27 67.31,30.99 67.82,30.48 69.34,30.48 v69.6,30.23
9
  Top 0.813: BOARD.D18 JP11.9 SIGNAL_4.9
10
  Top 0.813: BOARD.D19 JP11.10 SIGNAL_4.10
11  (via drill 0.35)
  Top 0.254: BOARD.D21 84.58,38.61 83.31,37.34 v69.6,37.34
  Top 0.813: BOARD.D21 JP11.11 SIGNAL_4.11
  Bottom 0.254: RELAY_CONTROL.2 48.01,38.1 48.77,37.34 v69.6,37.34
12
  Top 0.813: BOARD.D3 JP11.12 SIGNAL_4.12
13
  Top 0.813: BOARD.D1 JP11.13 SIGNAL_4.13
14
  Top 0.813: BOARD.D22 JP11.14 SIGNAL_4.14
15
  Top 0.813: BOARD.D23 JP11.15 SIGNAL_4.15
18
  Top 0.813: SIGNAL_3.3 JP12.3 BOARD.D13 JP13.3
19
  Top 0.813: SIGNAL_3.4 JP12.4 BOARD.D12 JP13.4
20
  Top 0.813: SIGNAL_3.5 JP12.5 BOARD.D14 JP13.5
21
  Top 0.813: SIGNAL_3.6 JP12.6 60.2,25.91 BOARD.D27 JP13.6
22
  Top 0.813: SIGNAL_3.7 JP12.7 BOARD.D26 JP13.7
23
  Top 0.813: SIGNAL_3.8 JP12.8 59.69,30.99 BOARD.D25 JP13.8
24
  Top 0.813: SIGNAL_3.9 JP12.9 BOARD.D33 JP13.9
25
  Top 0.813: SIGNAL_3.10 JP12.10 BOARD.D32 JP13.10
26
  Top 0.813: SIGNAL_3.11 JP12.11 BOARD.D35 JP13.11
27
  Top 0.813: SIGNAL_3.12 JP12.12 BOARD.D34 JP13.12
28
  Top 0.813: SIGNAL_3.13 JP12.13 BOARD.VN JP13.13
29  (via drill 0.35)
  Top 0.813: SIGNAL_3.14 JP12.14 BOARD.VP JP13.14 71.63,46.23 72.14,46.74 v72.14,50.04
  Bottom 0.813: v72.14,50.04 72.14,59.18 71.37,59.94 JP1.1
30
  Top 0.813: SIGNAL_3.15 JP12.15 BOARD.EN | BOARD.EN 60.71,48.77 | 60.71,48.77 60.96,48.51 60.71,48.51 BOARD.EN | JP13.15 60.71,48.77
+5V  (via drill 0.35)
  Top 0.406: VCC_SELECT.1 45.72,14.48 45.72,18.29 | 45.72,18.29 45.72,23.37 | 45.72,23.37 45.72,40.64 45.43,40.93 R9.2 R7.2 R3.2 R1.2 R5.2 45.43,53.59 45.09,53.93 D3.1 42.67,55.37 42.16,55.88 | IC2.3 45.56,18.44 45.72,18.29 | C1.2 45.78,23.31 45.72,23.37
  Top 0.813: IC1.4 75.61,70.69 v75.44,70.87 | v66.8,72.9 66.67,73.03 66.67,75.95 | 66.67,75.95 L1.2 | 66.67,75.95 66.8,76.08 66.8,80.52 65.28,82.04 48.77,82.04 47.24,80.52 C3.1 45.47,77.72 43.94,76.2 43.94,73.16 42.93,72.15 | v36.32,55.49 41.78,55.49 42.16,55.88 v42.8,56.52 44.2,57.91 44.2,71.12 43.17,72.15 42.93,72.15 | D1.1 32.64,48.51 | K3.3 K5.3 30.73,19.57 32.77,21.6 D5.1 32.9,23.62 v34.54,23.62 | K6.1 30.73,34.29 31.24,34.8 32.63,34.8 D4.1 | SIGNAL_3.1 JP12.1 BOARD.VIN JP13.1 | 42.93,72.15 K1.6
  Bottom 0.813: v75.44,70.87 73.66,72.64 67.06,72.64 v66.8,72.9 | K2.1 32,50.29 | 32,50.29 33.53,50.29 | 33.53,50.29 35.56,50.29 | v36.32,55.49 36.32,51.05 35.56,50.29 | 35.56,50.29 36.32,49.53 36.32,42.93 35.81,42.42 | 35.81,42.42 35.81,41.15 | 35.81,41.15 35.81,35.81 34.67,34.67 | D4.1 34.67,34.67 | D1.1 32.77,49.53 | 32.77,49.53 32,50.29 | 32.77,49.53 33.53,50.29 | 34.67,34.67 35.81,33.52 35.81,24.64 34.8,23.62 v34.54,23.62 | 35.17,41.78 35.18,41.78 35.81,41.15 | 35.17,41.78 35.81,42.42 | VCC_SELECT.1 44.7,10.67 46.74,8.64 55.12,8.64 55.63,9.14 55.63,12.95 SIGNAL_3.1 | JP13.1 69.34,13.21 70.87,14.73 70.87,54.36 70.1,55.12 64.26,55.12 | v42.8,56.52 44.2,55.12 62.23,55.12 | 64.26,55.12 62.23,55.12 | 35.17,41.78 D2.1 | JP1.2 64.26,59.94 63.25,58.93 63.25,56.13 | 63.25,56.13 62.23,55.12 | 63.25,56.13 64.26,55.12
  other vias: 32.77,34.67 32.77,48.64 32.77,41.78
COM1
  Bottom 2: RELAY2.2 9.14,53.09 10.41,51.82 10.41,47.24 13.37,44.29 K2.5
COM2
  Bottom 2: RELAY1.2 21.59,68.58 23.92,66.25 23.92,66.08 | K1.2 23.92,64.52 23.92,66.08 | K1.1 38.85,67.31 25.15,67.31 23.92,66.08
COM3
  Bottom 2: RELAY3.2 14.64,28.29 K6.5
COM4
  Top 2: RELAY5.1 11.18,10.16 12.95,11.94 K3.1
COM5
  Top 2: RELAY4.1 5.33,19.56 6.1,18.8 K5.1
GND  (via drill 0.35)
  Top 0.813: C16.2 77.38,68.37 IC1.5 77.31,73 | INPUT.2 78.23,73.91 77.31,73 | 77.31,73 77.16,73.15 74.42,73.15 | 74.42,73.15 73.66,73.91 73.66,78.73 IC1.6 | 74.42,73.15 73.91,72.64 IC1.3 73.91,65.53 73.41,65.02 67.56,65.02 66.92,65.67 D8.2 | JP13.2 BOARD.GND JP12.2 SIGNAL_3.2
  other vias: 29.97,36.58 37.85,38.86 37.34,34.29 38.61,29.72 38.1,26.92 48.26,27.18 44.2,21.59 40.39,21.84 37.59,18.29 40.39,16.51 47.75,16.76 48.01,11.43 43.94,8.89 37.34,8.89 60.71,7.62 75.95,14.22 95.76,9.14 82.55,55.88 91.95,60.45 84.33,55.88 86.36,55.88 62.74,75.44 53.34,71.63 41.66,61.21 48.01,40.13 43.43,40.13 34.04,39.88 37.85,43.43 38.1,45.97 34.8,48.01 33.27,52.32 34.8,43.69 38.1,41.4 37.85,48.01 38.35,50.8
  pour Top (hatched): 99.06,84.07 99.06,0 29.21,0 29.21,20.32 24.89,20.32 24.89,23.88 31.24,23.88 31.24,32.77 24.89,32.77 24.89,39.88 31.24,39.88 31.24,48.01 24.89,48.01 24.89,51.82 30.99,57.91 34.54,57.91 34.54,63.25 42.93,63.25 42.93,70.61 35.31,70.61 35.31,84.07
  pour Bottom (hatched): 35.31,84.07 99.06,84.07 99.06,0 29.21,0 29.21,20.32 24.89,20.32 24.89,23.88 31.24,23.88 31.24,32.77 24.89,32.77 24.89,39.88 31.24,39.88 31.24,48.01 24.89,48.01 24.89,51.82 30.99,57.91 34.54,57.91 34.54,63.25 42.93,63.25 42.93,70.61 35.31,70.61
IN1  (via drill 0.35)
  Top 0.406: R6.2 v37.85,49.28
  Bottom 0.406: v37.85,49.28 39.37,49.28 41.4,47.24 RELAY_CONTROL.1
IN2  (via drill 0.35)
  Top 0.406: R2.2 v37.85,44.7
  Bottom 0.406: v37.85,44.7 39.83,44.7 40.08,44.45 40.08,38.05 39.37,37.34 39.37,34.54 39.62,34.29 40.13,34.29 RELAY_CONTROL.3
IN3  (via drill 0.35)
  Top 0.406: R4.2 v37.85,40.13
  Bottom 0.406: v37.85,40.13 39.27,40.13 39.52,39.88 39.52,38.76 38.81,38.05 38.81,33.02 RELAY_CONTROL.5
IN4  (via drill 0.35)
  Top 0.406: R8.2 v38.08,35.56
  Bottom 0.406: v38.08,35.56 38.25,35.39 38.25,32.08 39.37,30.96 39.37,30.48 RELAY_CONTROL.7
IN5
  Top 0.406: R10.2 37.05,27.94 RELAY_CONTROL.9
N$1
  Top 0.406: RL3.2 R3.1
N$2
  Top 0.406: RL2.2 R1.1
N$3  (via drill 0.35)
  Top 0.254: D1.2 34.17,44.84 34.54,45.21 34.54,46.74 34.8,46.99 36.07,46.99 | RL2.1 39.37,49.53 38.86,49.02 38.86,47.5 38.35,46.99 36.83,46.99 36.58,46.99 | 36.07,46.99 36.58,46.99 | Q1.3 36.32,47.24 | 36.32,47.24 36.07,46.99 | 36.32,47.24 36.58,46.99
  Bottom 0.406: K2.4 31.18,38.29 32,39.12 32,44.58 32.26,44.84 D1.2
  other vias: 32.77,44.84
N$4
  Top 0.406: Q1.1 35.67,44.78 R2.1
N$5  (via drill 0.35)
  Top 0.254: D2.2 32.89,38.1 34.04,38.1 34.8,38.86 34.8,41.91 35.31,42.42 36.07,42.42 | 36.07,42.42 36.58,42.42 | 36.58,42.42 36.83,42.42 37.11,42.42 38.35,42.42 38.86,42.93 38.86,46.48 39.37,46.99 RL3.1 | Q2.3 36.32,42.67 | 36.32,42.67 36.07,42.42 | 36.32,42.67 36.58,42.42
  Bottom 0.406: D2.2 32.77,36.32 31.5,35.05 31.5,33.78 32,33.27 32,30.48 32.51,29.97 32.51,22.86 31.94,22.29 K6.4
  other vias: 32.77,37.98
N$6
  Top 0.406: Q2.1 35.67,40.21 R4.1
N$7
  Top 0.406: R5.1 RL1.2
N$8  (via drill 0.35)
  Top 0.254: Q3.3 38.62,52.56 39.12,52.07
  Top 0.406: 39.12,52.07 RL1.1 40.13,52.14 v40.13,54.36 | v40.13,56.64 40.13,61.21 39.4,61.95 K1.5 | v48.01,53.59 48.51,53.59 49.02,54.1 49.02,55.24 D3.2
  Bottom 0.406: v40.13,54.36 v40.13,56.64 | v40.13,54.36 40.13,54.1 | v40.13,54.36 40.89,53.59 v48.01,53.59
N$9
  Top 0.406: Q3.1 35.67,49.35 R6.1
N$10
  Top 0.406: RL4.2 R7.1
N$11  (via drill 0.35)
  Top 0.254: D4.2 34.17,30.87 34.54,31.24 34.54,37.59 34.8,37.85 36.07,37.85 | RL4.1 39.62,44.45 39.37,44.2 39.37,42.86 38.86,42.35 38.86,38.35 38.35,37.85 36.58,37.85 | 36.07,37.85 36.58,37.85 | 36.32,38.1 36.07,37.85 | Q4.3 36.32,38.1 | 36.32,38.1 36.58,37.85
  Bottom 0.406: D4.2 33.27,30.36 K5.4
  other vias: 32.77,30.87
N$12
  Top 0.406: Q4.1 35.67,35.64 R8.1
N$13
  Top 0.406: RL5.2 R9.1
N$14
  Top 0.254: 36.32,33.27 36.32,33.02 | 36.32,33.02 36.32,27.94 35.94,27.56 | RL5.1 39.62,41.91 39.27,41.55 39.27,33.78 38.76,33.27 36.58,33.27 | Q5.3 36.32,33.53 | 36.32,33.53 36.32,33.27 | 36.32,33.27 36.58,33.27 | 36.32,33.53 36.58,33.27 | 36.58,33.27 36.32,33.02
  Top 0.406: D5.2 35.94,27.55 | 35.94,27.55 35.94,27.56 | 35.94,27.55 36.32,27.17 36.32,13.46 35.81,12.95 K3.4
N$15
  Top 0.406: Q5.1 35.67,31.61 35.56,31.5 35.56,31.03 R10.1
N$18
  Top 0.813: IC1.2 72.21,70.53 71.63,71.12 63.5,71.12 62.62,70.24 D8.1 59.69,68.07 59.18,68.58 59.18,75.95 58.67,76.45 L1.1
N$38
  Top 0.406: IC2.2 42.42,25.15 | 42.42,25.15 IC2.4 | C2.2 38.1,24.89 38.35,25.15 42.42,25.15
N$39
  Top 0.813: VCC_SELECT.2 42.16,5.21 VCC.6 | VCC.6 VCC.4 VCC.2 VCC.1 VCC.3 VCC.5 VCC.7 VCC.8 | VCC.8 VCC.6 | VCC_4.1 VCC_4.2 VCC_4.3 VCC_4.4 VCC_4.5 VCC_4.6 VCC_4.7 VCC_4.8 VCC_4.9 VCC_4.10 VCC_4.11 VCC_4.12 VCC_4.13 VCC_4.14 VCC_4.15 93.47,51.05 92.96,51.56 53.34,51.56 52.83,51.05 VCC_3.1 VCC_3.2 VCC_3.3 VCC_3.4 VCC_3.5 VCC_3.6 VCC_3.7 VCC_3.8 VCC_3.9 VCC_3.10 VCC_3.11 VCC_3.12 VCC_3.13 VCC_3.14 VCC_3.15 52.83,10.41 51.82,9.4 46.74,9.4 45.47,8.13 VCC.8
NC1
  Bottom 2: RELAY2.1 14.22,39.12 K2.3
NC2
  Top 2: RELAY1.1 12.19,63.5 13.72,65.02 13.72,75.44 13.82,75.54 K1.4
NC3
  Bottom 2: RELAY3.1 14.22,23.63 K6.3
NO1
  Bottom 2: RELAY2.3 12.45,58.17 14.22,56.39 14.22,50.3 K2.2
NO2
  Bottom 2: RELAY1.3 8.13,73.66 9.91,75.44 9.91,79.5 11.43,81.03 20.07,81.03 21.42,79.68 K1.3
NO3
  Bottom 2: RELAY3.3 13.72,34.29 K6.2
NO4
  Top 2: K3.2 20.57,14.48 19.56,15.49 10.67,15.49 10.41,15.24 RELAY5.2
NO5
  Bottom 2: RELAY4.2 7.11,26.42 9.65,23.88 9.65,17.53 11.18,16 19.3,16 20.57,17.27 K5.2
VCC
  Top 0.813: INPUT.1 87.38,69.09 86.75,68.46 FB1.2
VCC/2  (via drill 0.35)
  Top 0.813: C17.1 86.87,63.79 86.87,66.04 86.24,66.66 FB1.1 80.35,66.66 C16.1 80.52,66.5 80.52,64.26 v80.26,64.01 81.79,64.01 | IC1.1 70.5,68.33 v69.09,68.33
  Bottom 0.406: VIN.4 VIN.3
  Bottom 0.813: v69.09,68.33 68.33,67.56 68.33,64.77 | 68.33,64.77 69.09,64.01 v80.26,64.01 | 68.33,64.77 67.56,64.01 56.13,64.01 VIN.7 | VIN.7 VIN.8 VIN.6 VIN.4 VIN.2 VIN.1 VIN.3 VIN.5 VIN.7

### Text on the board
tPlace: 5-30VDC | - | + | DESIGN BY / POSITRON / ELEKTRONIK | 3V3 | 5V | NODEMCU-AMICA | ESP32-DEVKIT | ESP32/NODEMCU / RELAY SHIELD | NODEMCU-LOLIN
bPlace: NO | COM | NC | NO | COM | NC | NO | COM | NC | NO | COM | NO | COM
tNames: NODEMCU V3 / VBUS to 5V